# Altium schematic sheet Peripherals.SchDoc
size A; SheetNumber: 3; SheetTotal: 4
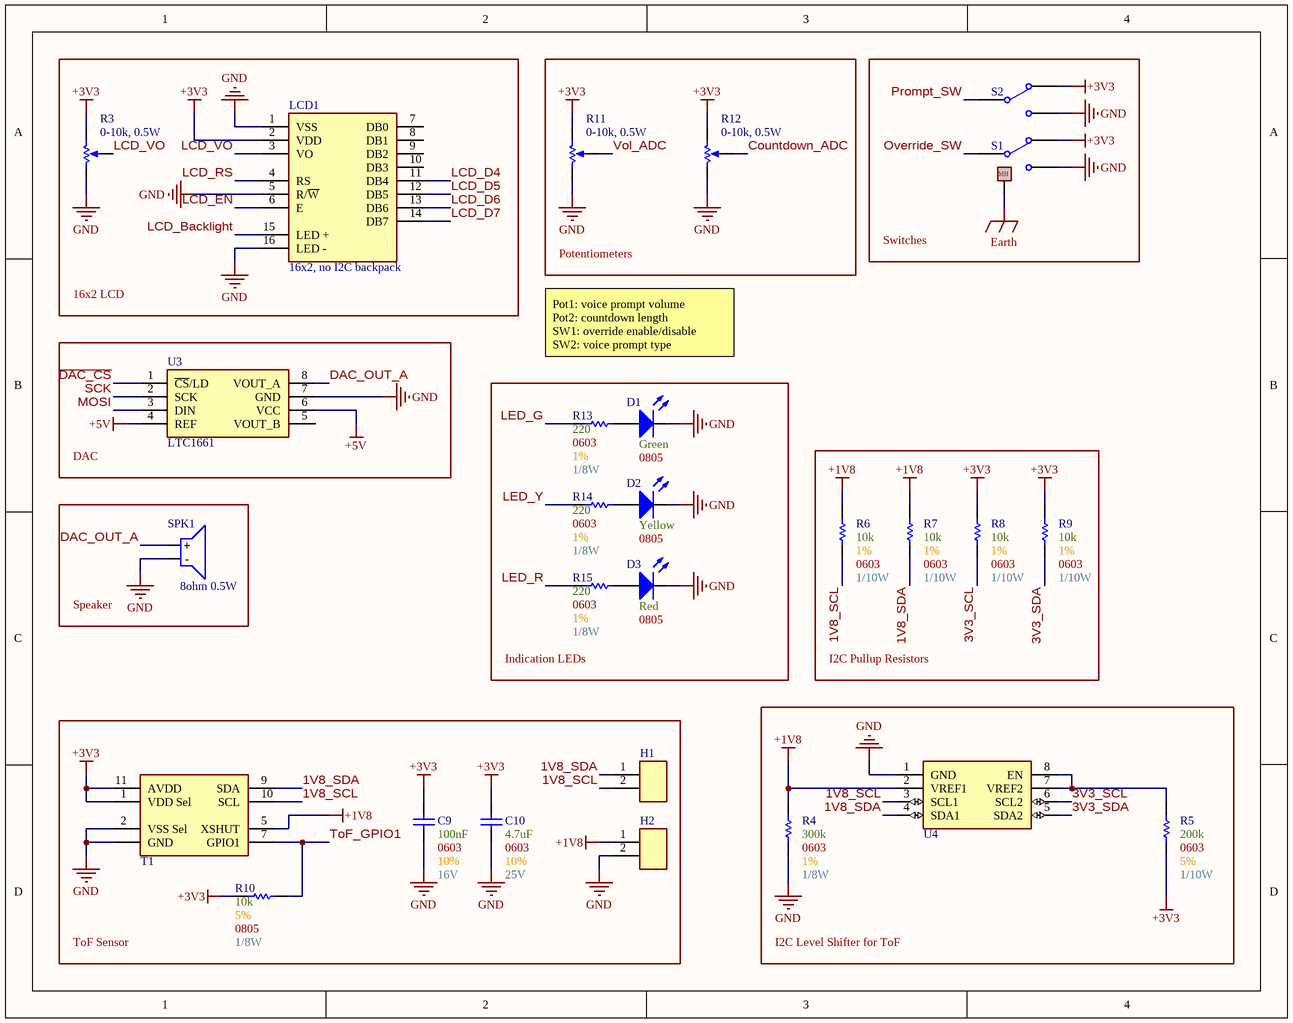
[diagram p0: Peripherals.SchDoc]

## Parts
C9  Max Voltage: 16V  Size Package: 0603  Tolerance: 10%  Capacitance: 100nF  [[Cap] SMD 0603]  (hidden comment: [Cap] 0603 0.1uF 10% 16V)
C10  Max Voltage: 25V  Size Package: 0603  Tolerance: 10%  Capacitance: 4.7uF  [[Cap] SMD 0603]  (hidden comment: [Cap] 0603 4.7uF 10% 25V)
D1  Color: Green  Size Package: 0805  [[LED] SMD 0805]  (hidden comment: [LED] SMD 0805 Green)
D2  Color: Yellow  Size Package: 0805  [[LED] SMD 0805]  (hidden comment: [LED] SMD 0805 Yellow)
D3  Color: Red  Size Package: 0805  [[LED] SMD 0805]  (hidden comment: [LED] SMD 0805 Red)
H1  1x2 Header  [[Header] 1x2 Male]  (value not drawn)
H2  1x2 Header  [[Header] 1x2 Male]  (value not drawn)
LCD1  16x2, no I2C backpack  [[LCD] 16x2 Parallel]
R3  0-10k, 0.5W  [[Potentiometer] 10k 0.5W (2)]
R4  Wattage: 1/8W  Tolerance: 1%  Resistance: 300k  Size Package: 0603  [[Res] SMD 0603]  (hidden comment: [300k] SMD 0603 1% 1/10W)
R5  Wattage: 1/10W  Tolerance: 5%  Resistance: 200k  Size Package: 0603  [[Res] SMD 0603]  (hidden comment: [200k] SMD 0603 1% 1/10W)
R6  Wattage: 1/10W  Tolerance: 1%  Resistance: 10k  Size Package: 0603  [[Res] SMD 0603]  (hidden comment: [10k] SMD 0603 1% 1/8W)
R7  Wattage: 1/10W  Tolerance: 1%  Resistance: 10k  Size Package: 0603  [[Res] SMD 0603]  (hidden comment: [10k] SMD 0603 1% 1/8W)
R8  Wattage: 1/10W  Tolerance: 1%  Resistance: 10k  Size Package: 0603  [[Res] SMD 0603]  (hidden comment: [10k] SMD 0603 1% 1/8W)
R9  Wattage: 1/10W  Tolerance: 1%  Resistance: 10k  Size Package: 0603  [[Res] SMD 0603]  (hidden comment: [10k] SMD 0603 1% 1/8W)
R10  Wattage: 1/8W  Tolerance: 5%  Resistance: 10k  Size Package: 0805  [[Res] SMD 0603]  (hidden comment: [10k] SMD 0603 1% 1/8W)
R11  0-10k, 0.5W  [[Potentiometer] 10k 0.5W (2)]
R12  0-10k, 0.5W  [[Potentiometer] 10k 0.5W (2)]
R13  Wattage: 1/8W  Tolerance: 1%  Resistance: 220  Size Package: 0603  [[Res] SMD 0603]  (hidden comment: [220] SMD 0603 1% 1/10W)
R14  Wattage: 1/8W  Tolerance: 1%  Resistance: 220  Size Package: 0603  [[Res] SMD 0603]  (hidden comment: [220] SMD 0603 1% 1/10W)
R15  Wattage: 1/8W  Tolerance: 1%  Resistance: 220  Size Package: 0603  [[Res] SMD 0603]  (hidden comment: [220] SMD 0603 1% 1/10W)
S1  [SPDT] Toggle  [[SPDT] Toggle]  (value not drawn)
S2  [SPDT] Slide Switch  [[SPDT] Slide Switch]  (value not drawn)
SPK1  8ohm 0.5W  [[Speaker] 8ohm 0.5W]
T1  [ToF] VL53L1X  [[ToF] VL53L1X]  (value not drawn)
U3  LTC1661  [[DAC] LTC1661]
U4  [Level Shifter] I2C Level Shifter  [[Level Shifter] I2C Level Shifter]  (value not drawn)

## Blocks framed on the sheet
16x2 LCD: LCD1 R3
Potentiometers: R11 R12
Switches: S1 S2
DAC: U3
Indication LEDs: D1-D3 R13-R15
Speaker: SPK1
I2C Pullup Resistors: R6-R9
ToF Sensor: C9 C10 H1 H2 R10 T1
I2C Level Shifter for ToF: R4 R5 U4

## Nets
+1V8: H2.1 R4.2 R6.2 R7.2 T1.5(XSHUT) U4.2(VREF1)
+3V3: C9.2 C10.2 LCD1.2(VDD) R3.1(TOP) R5.1 R8.2 R9.2 R10.2 R11.1(TOP) R12.1(TOP) S1.3 S2.3 T1.1(VDD_Sel) T1.11(AVDD)
+5V: U3.4(REF) U3.6(VCC)
Earth: S1.X(Mount_Hole)
GND: C9.1 C10.1 D1.2(Cathode) D2.2(Cathode) D3.2(Cathode) H2.2 LCD1.1(VSS) LCD1.5(R/~{W}) LCD1.16(LED_-) R3.3(BOT) R4.1 R11.3(BOT) R12.3(BOT) S1.1 S2.1 SPK1.2(-) T1.2(VSS_Sel) T1.GND U3.7(GND) U4.1(GND)
1V8_SCL: H1.2 R6.1 T1.10(SCL) U4.3(SCL1)
1V8_SDA: H1.1 R7.1 T1.9(SDA) U4.4(SDA1)
3V3_SCL: R8.1 U4.6(SCL2)
3V3_SDA: R9.1 U4.5(SDA2)
~{DAC_CS}: U3.1(~{CS}/LD)
Countdown_ADC: R12.2(TAP)
DAC_OUT_A: SPK1.1(+) U3.8(VOUT_A)
LCD_Backlight: LCD1.15(LED_+)
LCD_D4: LCD1.11(DB4)
LCD_D5: LCD1.12(DB5)
LCD_D6: LCD1.13(DB6)
LCD_D7: LCD1.14(DB7)
LCD_EN: LCD1.6(E)
LCD_RS: LCD1.4(RS)
LCD_VO: LCD1.3(VO) R3.2(TAP)
LED_G: R13.1
LED_R: R15.1
LED_Y: R14.1
MOSI: U3.3(DIN)
Override_SW: S1.2
Prompt_SW: S2.2
SCK: U3.2(SCK)
ToF_GPIO1: R10.1 T1.7(GPIO1)
Vol_ADC: R11.2(TAP)
NetD1_1: D1.1(Anode) R13.2
NetD2_1: D2.1(Anode) R14.2
NetD3_1: D3.1(Anode) R15.2
NetR5_2: R5.2 U4.7(VREF2) U4.8(EN)

Not connected (* = marked no-connect by the designer): LCD1 7(DB0) 8(DB1) 9(DB2) 10(DB3); U3 5(VOUT_B)

## Notes on the sheet
- Pot1: voice prompt volume
  Pot2: countdown length
  SW1: override enable/disable
  SW2: voice prompt type
- (in symbol [SPDT] Toggle) MH

## Library data of the parts
C9 = [Cap] 0603 0.1uF 10% 16V: CC0603KRX7R7BB104; Supplier 1: DigiKey; Supplier Part Number 1: 311-1088-6-ND
C10 = [Cap] 0603 4.7uF 10% 25V: GRM188R61E475KE11D; Supplier 1: DigiKey; Supplier Part Number 1: 490-7203-6-ND
D1 = [LED] SMD 0805 Green: LG R971-KN-1-0-20-R18; Supplier 1: DigiKey; Supplier Part Number 1: 475-LGR971-KN-1CT-ND
D2 = [LED] SMD 0805 Yellow: LY R976-PS-36-0-20-R18; Supplier 1: DigiKey; Supplier Part Number 1: 475-LYR976-PS-36-0-20-R18CT-ND
D3 = [LED] SMD 0805 Red: LS R976-NR-1-0-20-R18; Supplier 1: DigiKey; Supplier Part Number 1: 475-LSR976-NR-1CT-ND
H1 H2 = [Header] 1x2 Male: 2.54mm pitch
LCD1 = [LCD] 16x2 Parallel: Sunfounder
R3 R11 R12 = [Potentiometer] 10k 0.5W: 3386T-1-103LF; Supplier 1: DigiKey; Supplier Part Number 1: 118-3386T-1-103LF-ND
R4 = [300k] SMD 0603 1% 1/10W: CRCW0603300KFKEA; Supplier 1: DigiKey; Supplier Part Number 1: 541-300KHCT-ND
R5 = [200k] SMD 0603 1% 1/10W: RC0603JR-07200KL; Supplier 1: DigiKey; Supplier Part Number 1: 311-200KGRCT-ND
R6-R9 = [10k] SMD 0603 1% 1/8W: RMCF0603FT10K0; Supplier 1: DigiKey; Supplier Part Number 1: RMCF0603FT10K0DKR-ND
R10 = [10k] SMD 0603 1% 1/8W: RC0805JR-0710KL; Supplier 1: DigiKey; Supplier Part Number 1: 311-10KARCT-ND
R13-R15 = [220] SMD 0603 1% 1/10W: CRGCQ0805F220R; Supplier 1: DigiKey; Supplier Part Number 1: A129741CT-ND
S1 = [SPDT] Toggle: ANT11TFHQE
S2 = [SPDT] Slide Switch: 09.03290.01; Supplier 1: DigiKey; Supplier Part Number 1: 1948-1087-ND
SPK1 = [Speaker] 8ohm 0.5W: CMS-40558N-L152; Supplier 1: DigiKey; Supplier Part Number 1: 102-3851-ND
T1 = [ToF] VL53L1X: VL53L1CXV0FY/1; Supplier 1: DigiKey; Supplier Part Number 1: 497-17764-1-ND
U3 = [DAC] LTC1661: LTC1661CN8#PBF; Supplier 1: DigiKey; Supplier Part Number 1: LTC1661CN8#PBF-ND
U4 = [Level Shifter] I2C Level Shifter: PCA9306DCTR; Supplier 1: DigiKey; Supplier Part Number 1: 296-18509-1-ND